# Altium schematic sheet TemporizadorArmando.SchDoc
size A4
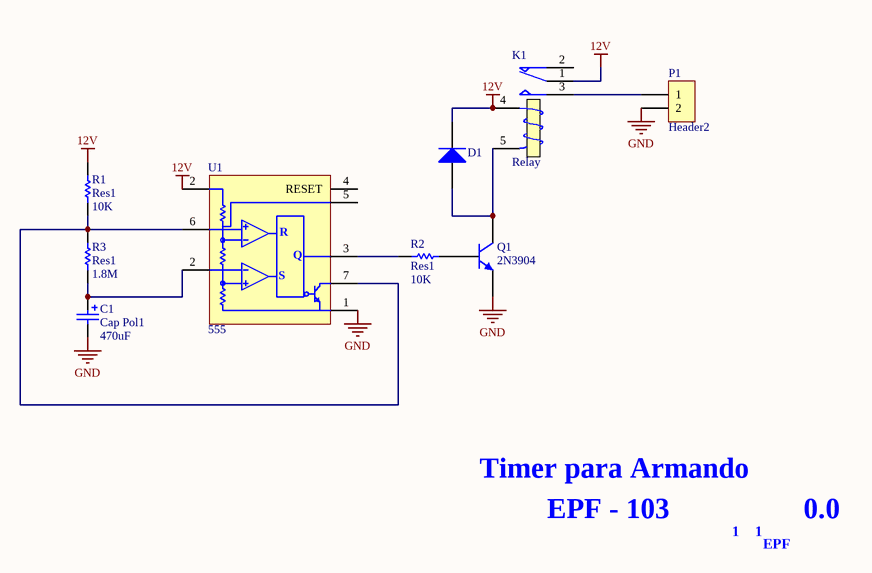
[diagram p0: TemporizadorArmando.SchDoc]

## Parts
C1  Cap Pol1  value 470uF  [RB7.6-15]
D1  Diode 1N4001  [DO-41]  (value not drawn)
K1  Relay  [MODULE5B]
P1  Header2  [Header2Macho]
Q1  2N3904  [BCY-W3/E4]
R1  Res1  value 10K  [AXIAL-0.3 3D]
R2  Res1  value 10K  [AXIAL-0.3 3D]
R3  Res1  value 1.8M  [AXIAL-0.3 3D]
U1  555

## Nets
12V: D1.2(K) K1.1(COM) K1.4(T1) R1.2 U1.2
GND: C1.2 P1.2 Q1.1(E) U1.1(GND)
NetC1_1: C1.1 R3.1 U1.2(TRIGGER)
NetD1_1: D1.1(A) K1.5(T2) Q1.3(C)
NetK1_3: K1.3(NO) P1.1
NetQ1_2: Q1.2(B) R2.2
NetR1_1: R1.1 R3.2 U1.6(THRESHOLD) U1.7(DISCHARGE)
NetR2_1: R2.1 U1.3(OUT)

Not connected (* = marked no-connect by the designer): K1 2(NC); U1 4(RESET) 5(CONTROL_VOLTAGE)

## Notes on the sheet
- Timer para Armando
- EPF - 103
- 1
- 0.0
- EPF
- (in symbol NE555) R; Q; S

## Library data of the parts
C1 = Cap Pol1: Polarized Capacitor (Radial); Published: 8-Jun-2000; LatestRevisionDate: 17-Jul-2002; LatestRevisionNote: Re-released for DXP Platform.; PackageReference: RB7.6-15; Publisher: Altium Limited
D1 = Diode 1N4001: 1 Amp General Purpose Rectifier; Published: 8-Jun-2000; LatestRevisionDate: 17-Jul-2002; LatestRevisionNote: Re-released for DXP Platform.; DatasheetVersion: 1998; PackageVersion: Aug-1999; PackageReference: DO-41; Publisher: Altium Limited; PackageDescription: Diode, Axial; Body 5.2 x 2.7 mm (LxDia. max), Lead Dia. 0.86 mm (max); Code_JEDEC: DO-204-AL; ComponentLink1Description: Manufacturer Link; ComponentLink1URL: http://www.fairchildsemi.com/; ComponentLink2Description: Datasheet; ComponentLink2URL: http://www.fairchildsemi.com/ds/1N%2F1N4001.pdf
K1 = Relay: SPDT Relay; Published: 8-Jun-2000; LatestRevisionDate: 17-Jul-2002; LatestRevisionNote: Re-released for DXP Platform.; PackageReference: MODULE5B; Publisher: Altium Limited
Q1 = 2N3904: NPN General Purpose Amplifier; Published: 8-Jun-2000; LatestRevisionDate: 15-Jan-2003; LatestRevisionNote: PCB Footprint 'BCY-W3/D4.7' replaced; DatasheetVersion: 1997; PackageVersion: Sep-1998; PackageReference: TO-92A; Publisher: Altium Limited; Code_JEDEC: TO-92A; ComponentLink1Description: Manufacturer Link; ComponentLink1URL: http://www.fairchildsemi.com/; ComponentLink2Description: Datasheet; ComponentLink2URL: http://www.fairchildsemi.com/ds/2N%2F2N3904.pdf
R1-R3 = Res1: Resistor; Published: 8-Jun-2000; LatestRevisionDate: 17-Jul-2002; LatestRevisionNote: Re-released for DXP Platform.; PackageReference: AXIAL-0.3; Publisher: Altium Limited
U1 = NE555